# Altium schematic sheet 显示模块.SchDoc
size A4; DocumentNumber: 4; SheetNumber: 4; SheetTotal: 8
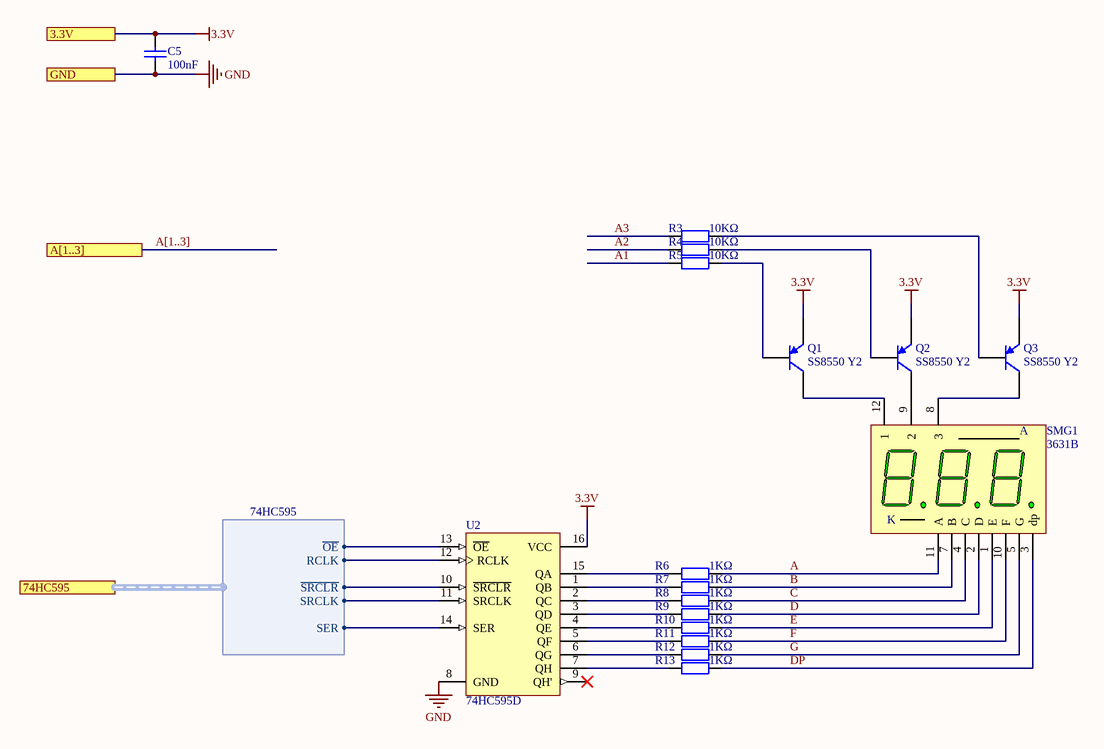
[diagram p0: 显示模块.SchDoc]

## Parts
C5  100nF  [LC-0603_C]
Q1  SS8550 Y2  [LC-SOT-23(SOT-23-3)]
Q2  SS8550 Y2  [LC-SOT-23(SOT-23-3)]
Q3  SS8550 Y2  [LC-SOT-23(SOT-23-3)]
R3  10KΩ  [LC-0603_R]
R4  10KΩ  [LC-0603_R]
R5  10KΩ  [LC-0603_R]
R6  1KΩ  [LC-0603_R]
R7  1KΩ  [LC-0603_R]
R8  1KΩ  [LC-0603_R]
R9  1KΩ  [LC-0603_R]
R10  1KΩ  [LC-0603_R]
R11  1KΩ  [LC-0603_R]
R12  1KΩ  [LC-0603_R]
R13  1KΩ  [LC-0603_R]
SMG1  3631B  [SMG 0.36-3P]
U2  74HC595D  [LC-SOIC-16_150mil]

## Ports
3.3V, 74HC595 (harness 74HC595), A[1..3], GND

## Harnesses
74HC595: ~{OE}, RCLK, ~{SRCLR}, SRCLK, SER

## Nets
3.3V: C5.1 Q1.2(E) Q2.2(E) Q3.2(E) U2.16(VCC) ; port 3.3V
GND: C5.2 U2.8(GND) ; port GND
A: R6.2 SMG1.11(A)
A1: R5.1
A2: R4.1
A3: R3.1
B: R7.2 SMG1.7(B)
C: R8.2 SMG1.4(C)
D: R9.2 SMG1.2(D)
DP: R13.2 SMG1.3(dp)
E: R10.2 SMG1.1(E)
F: R11.2 SMG1.10(F)
G: R12.2 SMG1.5(G)
NetQ1_1: Q1.1(B) R5.2
NetQ1_3: Q1.3(C) SMG1.12(1)
NetQ2_1: Q2.1(B) R4.2
NetQ2_3: Q2.3(C) SMG1.9(2)
NetQ3_1: Q3.1(B) R3.2
NetQ3_3: Q3.3(C) SMG1.8(3)
NetR6_1: R6.1 U2.15(QA)
NetR7_1: R7.1 U2.1(QB)
NetR8_1: R8.1 U2.2(QC)
NetR9_1: R9.1 U2.3(QD)
NetR10_1: R10.1 U2.4(QE)
NetR11_1: R11.1 U2.5(QF)
NetR12_1: R12.1 U2.6(QG)
NetR13_1: R13.1 U2.7(QH)
NetU2_10: U2.10(~{SRCLR}) ; port 74HC595.~{SRCLR}
NetU2_11: U2.11(SRCLK) ; port 74HC595.SRCLK
NetU2_12: U2.12(RCLK) ; port 74HC595.RCLK
NetU2_13: U2.13(~{OE}) ; port 74HC595.~{OE}
NetU2_14: U2.14(SER) ; port 74HC595.SER

Not connected (* = marked no-connect by the designer): U2 9(QH')*

## Buses and harness runs
bus A[1..3] = port A[1..3]

## Notes on the sheet
- (in symbol 3631B) K

## Library data of the parts
C5 = 0603 100nF (104) 10% 50V: 贴片电容; ComponentLink1Description: 供应商链接; ComponentLink1URL: http://www.szlcsc.com/product/details_15331.html; Package: 0603; Supplier: LC; SuppliersPartNumber: C14663
Q1-Q3 = SOT-23 SS8550 Y2: 三极管; ComponentLink1Description: 供应商链接; ComponentLink1URL: http://www.szlcsc.com/product/details_9037.html; Package: SOT-23; Supplier: LC; SuppliersPartNumber: C8542
R3-R5 = 0603 10KΩ (1002) 1%: 贴片电阻; ComponentLink1Description: 供应商链接; ComponentLink1URL: http://www.szlcsc.com/product/details_26547.html; Package: 0603; Supplier: LC; SuppliersPartNumber: C25804
R6-R13 = 0603 1KΩ (1001) 1%: 贴片电阻; ComponentLink1Description: 供应商链接; ComponentLink1URL: http://www.szlcsc.com/product/details_21904.html; Package: 0603; Supplier: LC; SuppliersPartNumber: C21190
SMG1 = 3631B: 0.36寸3位共阳数码管; 版权归属: 封装库来自淘宝 ID：黄晶宝石; BOM名称: 0.36寸3位共阳; 学习资源: https://shop463601444.taobao.com
U2 = 74HC595D: 74系列逻辑芯片; ComponentLink1Description: 供应商链接; ComponentLink1URL: http://www.szlcsc.com/product/details_6413.html; Package: SOIC-16_150mil; Supplier: LC; SuppliersPartNumber: C5947